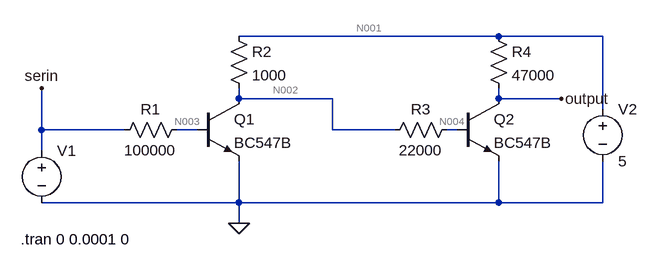
[diagram p0: schematic serout.asc]
serout.asc, the LTspice schematic file:
Version 4.1
SHEET 1 880 680
WIRE -1664 -1728 -2064 -1728
WIRE -1504 -1728 -1664 -1728
WIRE -2064 -1632 -2064 -1648
WIRE -1920 -1632 -2064 -1632
WIRE -1664 -1632 -1664 -1648
WIRE -1568 -1632 -1664 -1632
WIRE -1504 -1616 -1504 -1728
WIRE -2368 -1584 -2368 -1648
WIRE -2240 -1584 -2368 -1584
WIRE -2128 -1584 -2160 -1584
WIRE -1920 -1584 -1920 -1632
WIRE -1824 -1584 -1920 -1584
WIRE -1728 -1584 -1744 -1584
WIRE -2368 -1552 -2368 -1584
WIRE -2064 -1472 -2064 -1536
WIRE -2064 -1472 -2368 -1472
WIRE -1664 -1472 -1664 -1536
WIRE -1664 -1472 -2064 -1472
WIRE -1504 -1472 -1504 -1536
WIRE -1504 -1472 -1664 -1472
WIRE -2064 -1440 -2064 -1472
FLAG -1568 -1632 output
FLAG -2064 -1440 0
FLAG -2368 -1648 serin
SYMBOL voltage -2368 -1568 R0
WINDOW 3 24 96 Invisible 2
WINDOW 123 0 0 Left 0
WINDOW 39 24 44 Left 2
SYMATTR Value EXP(0 5 0 0.000001 0.000052 0.0000001)
SYMATTR InstName V1
SYMBOL npn -2128 -1632 R0
SYMATTR InstName Q1
SYMATTR Value BC547B
SYMBOL res -2144 -1600 R90
WINDOW 0 0 56 VBottom 2
WINDOW 3 32 56 VTop 2
SYMATTR InstName R1
SYMATTR Value 100000
SYMBOL voltage -1504 -1632 R0
WINDOW 123 0 0 Left 0
WINDOW 39 24 44 Left 2
SYMATTR InstName V2
SYMATTR Value 5
SYMBOL res -2080 -1744 R0
SYMATTR InstName R2
SYMATTR Value 1000
SYMBOL npn -1728 -1632 R0
SYMATTR InstName Q2
SYMATTR Value BC547B
SYMBOL res -1728 -1600 R90
WINDOW 0 0 56 VBottom 2
WINDOW 3 32 56 VTop 2
SYMATTR InstName R3
SYMATTR Value 22000
SYMBOL res -1680 -1744 R0
SYMATTR InstName R4
SYMATTR Value 47000
TEXT -2400 -1416 Left 2 !.tran 0 0.0001 0

The netlist it stands for:
* serout.asc
V1 serin 0 EXP(0 5 0 0.000001 0.000052 0.0000001)
Q1 N002 N003 0 0 BC547B
R1 N003 serin 100000
V2 N001 0 5
R2 N001 N002 1000
Q2 output N004 0 0 BC547B
R3 N004 N002 22000
R4 N001 output 47000
.model NPN NPN
.model PNP PNP
.lib standard.bjt
.tran 0 0.0001 0
.backanno
.end

* Results of the author's LTspice run, read from the files saved beside the schematic
* Operating Point, zero values left out:
*   V(n001) = 5 V
*   V(n002) = 4.811 V
*   V(n003) = 487.7 nV
*   V(n004) = 649.3 mV
*   V(output) = 8.566 mV
*   I(R1) = 4.877 pA
*   I(R2) = 189.2 µA
*   I(R3) = -189.2 µA
*   I(R4) = 106.2 µA
*   I(V1) = 4.877 pA
*   I(V2) = -295.4 µA
*   Ib(Q1) = -4.877 pA
*   Ib(Q2) = 189.2 µA
*   Ic(Q1) = 4.902 pA
*   Ic(Q2) = 106.2 µA
*   Ie(Q2) = -295.4 µA
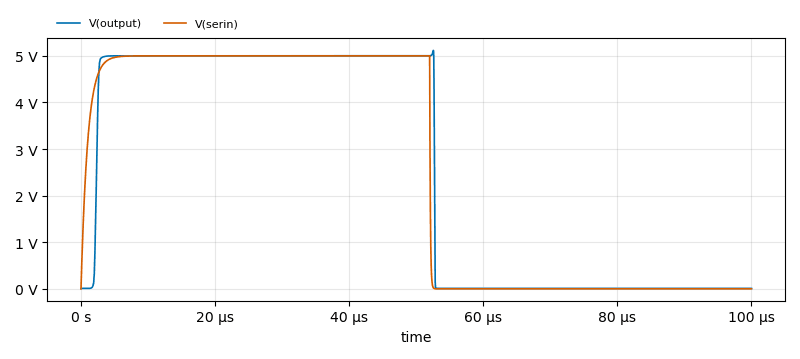
[diagram p1: Transient Analysis of serout.asc, plotted from the saved traces]
* Transient Analysis, 1 run:
*   V(output): min 8.564 mV, max 5.118 V, average 2.524 V, rms 3.544 V, last 8.566 mV
*   V(serin): min 0 V, max 5 V, average 2.555 V, rms 3.555 V, last 0 V